# Altium schematic sheet circle.SchDoc
size A3
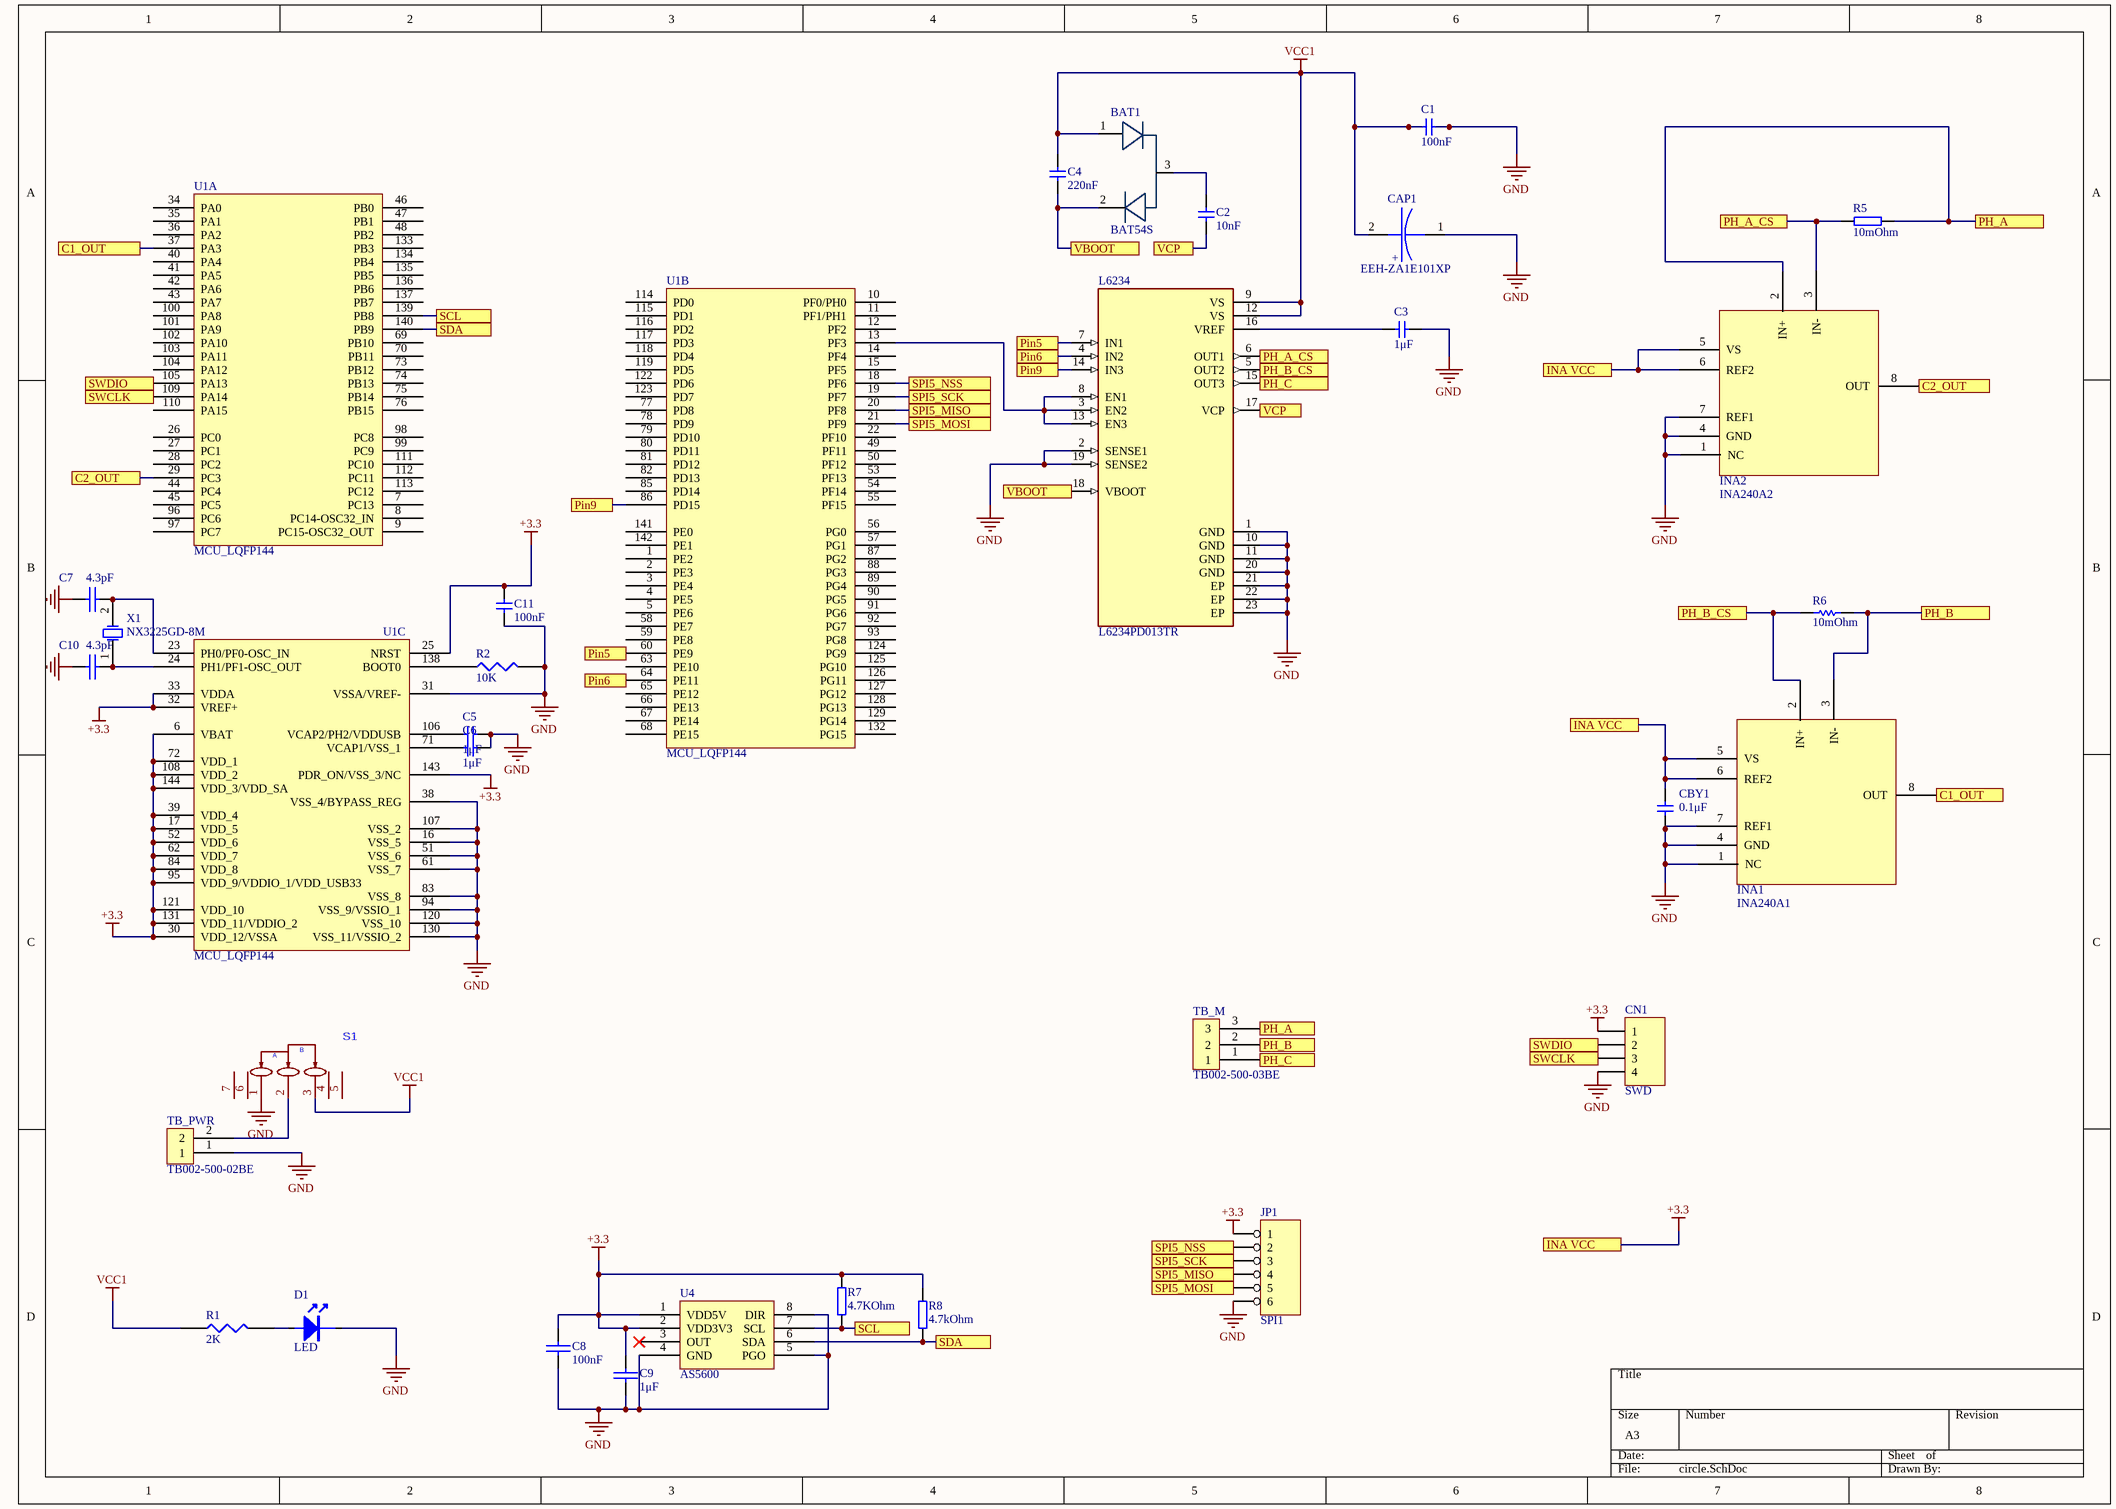
[diagram p0: circle.SchDoc]

## Parts
BAT1  BAT54S  [BAT54s]
C1  100nF  [0603C]
C2  10nF  [0603C]
C3  1μF  [0603C]
C4  220nF  [0603C]
C5  1μF  [0603C]
C6  1μF  [0603C]
C7  4.3pF  [0603C]
C8  100nF  [0603C]
C9  1μF  [0603C]
C10  4.3pF  [0603C]
C11  100nF  [0603C]
CAP1  EEH-ZA1E101XP  [EEH-ZA1E101XP]
CBY1  0.1μF  [0603C]
CN1  SWD  [CONN-TH_PH2.0-4P]
D1  LED  [D0805+]
INA1  INA240A1  [INA240]
INA2  INA240A2  [INA240]
JP1  SPI1  [SHDR6]
L6234  L6234PD013TR  [SOIC127P1420X360-21N]
R1  2K  [0603R]
R2  10K  [0603R]
R5  10mOhm  [0603R]
R6  10mOhm  [0603R]
R7  4.7KOhm  [0603R]
R8  4.7kOhm  [0603R]
S1  (no value)  [SW-SMD_G-SWITCH_MK-12C02-G015]
TB_M  TB002-500-03BE  [10.7MHZ]
TB_PWR  TB002-500-02BE  [1*2_2.5mm]
U1  MCU_LQFP144  [LQFP144_0R5_SKT]  (parts A,B,C of 3)
U4  AS5600  [SOIC 8]
X1  NX3225GD-8M  [OSC_2SM_3R2x2R5]

## Ports
C1_OUT, C2_OUT, INA VCC, PH_A, PH_A_CS, PH_B, PH_B_CS, PH_C, Pin5, Pin6, Pin9, SCL, SDA, SPI5_MISO, SPI5_MOSI, SPI5_NSS, SPI5_SCK, SWCLK, SWDIO, VBOOT, VCP

## Nets
+3.3: C8.1 C9.1 C11.1 CBY1.1 CN1.1 INA1.5(VS) INA1.6(REF2) INA2.5(VS) INA2.6(REF2) JP1.1 R7.2 R8.2 U1.6(VBAT) U1.17(VDD_5) U1.25(NRST) U1.30(VDD_12/VSSA) U1.32(VREF+) U1.33(VDDA) U1.39(VDD_4) U1.52(VDD_6) U1.62(VDD_7) U1.72(VDD_1) U1.84(VDD_8) U1.95(VDD_9/VDDIO_1/VDD_USB33) U1.108(VDD_2) U1.121(VDD_10) U1.131(VDD_11/VDDIO_2) U1.143(PDR_ON/VSS_3/NC) U1.144(VDD_3/VDD_SA) U4.1(VDD5V) U4.2(VDD3V3) ; port INA VCC
GND: C1.2 C3.2 C5.2 C6.2 C7.2 C8.2 C9.2 C10.2 C11.2 CAP1.1 CBY1.2 CN1.4 D1.K INA1.1(NC) INA1.4(GND) INA1.7(REF1) INA2.1(NC) INA2.4(GND) INA2.7(REF1) JP1.6 L6234.1(GND) L6234.2(SENSE1) L6234.10(GND) L6234.11(GND) L6234.19(SENSE2) L6234.20(GND) L6234.21(EP) L6234.22(EP) L6234.23(EP) R2.2 S1.1 TB_PWR.1 U1.16(VSS_5) U1.31(VSSA/VREF-) U1.38(VSS_4/BYPASS_REG) U1.51(VSS_6) U1.61(VSS_7) U1.83(VSS_8) U1.94(VSS_9/VSSIO_1) U1.107(VSS_2) U1.120(VSS_10) U1.130(VSS_11/VSSIO_2) U4.4(GND) U4.5(PGO) U4.8(DIR)
VCC1: BAT1.1 C1.1 C4.1 CAP1.2(+) L6234.9(VS) L6234.12(VS) R1.1 S1.3
C1_OUT: INA1.8(OUT) U1.37(PA3) ; port C1_OUT
C2_OUT: INA2.8(OUT) U1.29(PC3) ; port C2_OUT
PH_A: INA2.2(IN+) R5.2 TB_M.3 ; port PH_A
PH_A_CS: INA2.3(IN-) L6234.6(OUT1) R5.1 ; port PH_A_CS
PH_B: INA1.3(IN-) R6.2 TB_M.2 ; port PH_B
PH_B_CS: INA1.2(IN+) L6234.5(OUT2) R6.1 ; port PH_B_CS
PH_C: L6234.15(OUT3) TB_M.1 ; port PH_C
Pin5: L6234.7(IN1) U1.60(PE9) ; port Pin5
Pin6: L6234.4(IN2) U1.64(PE11) ; port Pin6
Pin9: L6234.14(IN3) U1.86(PD15) ; port Pin9
SCL: R7.1 U1.139(PB8) U4.7(SCL) ; port SCL
SDA: R8.1 U1.140(PB9) U4.6(SDA) ; port SDA
SPI5_MISO: JP1.4 U1.20(PF8) ; port SPI5_MISO
SPI5_MOSI: JP1.5 U1.21(PF9) ; port SPI5_MOSI
SPI5_NSS: JP1.2 U1.18(PF6) ; port SPI5_NSS
SPI5_SCK: JP1.3 U1.19(PF7) ; port SPI5_SCK
SWCLK: CN1.3 U1.109(PA14) ; port SWCLK
SWDIO: CN1.2 U1.105(PA13) ; port SWDIO
VBOOT: BAT1.2 C4.2 L6234.18(VBOOT) ; port VBOOT
VCP: C2.2 L6234.17(VCP) ; port VCP
NetBAT1_3: BAT1.3 C2.1
NetC3_1: C3.1 L6234.16(VREF)
NetC5_1: C5.1 U1.106(VCAP2/PH2/VDDUSB)
NetC6_1: C6.1 U1.71(VCAP1/VSS_1)
NetC7_1: C7.1 U1.23(PH0/PF0-OSC_IN) X1.2(OSC2)
NetC10_1: C10.1 U1.24(PH1/PF1-OSC_OUT) X1.1(OSC1)
NetD1_A: D1.A R1.2
NetL6234_3: L6234.3(EN2) L6234.8(EN1) L6234.13(EN3) U1.13(PF3)
NetR2_1: R2.1 U1.138(BOOT0)
NetS1_2: S1.2 TB_PWR.2

Not connected (* = marked no-connect by the designer): S1 4 5 6 7; U1 1(PE2) 2(PE3) 3(PE4) 4(PE5) 5(PE6) 7(PC13) 8(PC14-OSC32_IN) 9(PC15-OSC32_OUT) 10(PF0/PH0) 11(PF1/PH1) 12(PF2) 14(PF4) 15(PF5) 22(PF10) 26(PC0) 27(PC1) 28(PC2) 34(PA0) 35(PA1) 36(PA2) 40(PA4) 41(PA5) 42(PA6) 43(PA7) 44(PC4) 45(PC5) 46(PB0) 47(PB1) 48(PB2) 49(PF11) 50(PF12) 53(PF13) 54(PF14) 55(PF15) 56(PG0) 57(PG1) 58(PE7) 59(PE8) 63(PE10) 65(PE12) 66(PE13) 67(PE14) 68(PE15) 69(PB10) 70(PB11) 73(PB12) 74(PB13) 75(PB14) 76(PB15) 77(PD8) 78(PD9) 79(PD10) 80(PD11) 81(PD12) 82(PD13) 85(PD14) 87(PG2) 88(PG3) 89(PG4) 90(PG5) 91(PG6) 92(PG7) 93(PG8) 96(PC6) 97(PC7) 98(PC8) 99(PC9) 100(PA8) 101(PA9) 102(PA10) 103(PA11) 104(PA12) 110(PA15) 111(PC10) 112(PC11) 113(PC12) 114(PD0) 115(PD1) 116(PD2) 117(PD3) 118(PD4) 119(PD5) 122(PD6) 123(PD7) 124(PG9) 125(PG10) 126(PG11) 127(PG12) 128(PG13) 129(PG14) 132(PG15) 133(PB3) 134(PB4) 135(PB5) 136(PB6) 137(PB7) 141(PE0) 142(PE1); U4 3(OUT)*

## Notes on the sheet
- (in symbol MK-12C02-G015) A; B

## Library data of the parts
C1-C6 C11 CBY1 = CAP_1
C7-C10 = CAP: Capacitor
CN1 = Header 4: Header, 4-Pin, Single row; Revision: 17-Jul-2002: Re-released for DXP Platform.; Publisher: Altium Limited
INA1 INA2 = INA240: Supplier 1: Mouser; Supplier Part Number 1: 595-INA240A2PWR
JP1 = HEADER 6
L6234 = L6234PD013TR: Motor Driver BiCDMOS Parallel PowerSO-20; MF: STMicroelectronics; Value: *; Digi-Key_Purchase_URL: https://www.digikey.com/product-detail/en/stmicroelectronics/L6234PD013TR/497-5352-1-ND/1154483?utm_source=snapeda&utm_medium=aggregator&utm_campaign=symbol; Package: SO-20 STMicroelectronics; SnapEDA_Link: https://www.snapeda.com/parts/L6234PD013TR/STMicroelectronics/view-part/75337/?ref=snap; Digi-Key_Part_Number: 497-5352-1-ND; MP: L6234PD013TR
R1 R2 = RES1
R5 R7 R8 = RES2
R6 = Res1: Resistor; Value: 1K; Ordered by: Subcon; Published: 8-Jun-2000; Revision: July-2002: Re-released for DXP Platform.; Publisher: Altium Limited
S1 = MK-12C02-G015
X1 = XTAL: Crystal Oscillator; Published: 8-Jun-2000; LatestRevisionDate: 17-Jul-2002; LatestRevisionNote: Re-released for DXP Platform.; PackageReference: R38; Publisher: Altium Limited
BAT1 = BAT54S: Supplier 1: Mouser; Supplier Part Number 1: 512-BAT54S
CAP1 = EEH-ZA1E101XP: Supplier 1: Mouser; Supplier Part Number 1: 667-EEH-ZA1E101XP
TB_M = TB002-500-03BE: Supplier 1: Mouser; Supplier Part Number 1: 490-TB002-500-03BE
TB_PWR = TB002-500-02BE: Supplier 1: Mouser; Supplier Part Number 1: 490-TB002-500-02BE